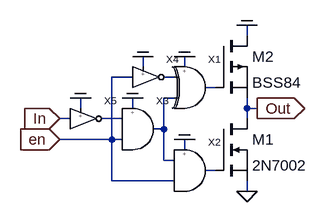
[diagram p0: schematic nm_enable.asc]
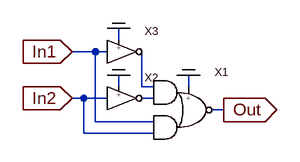
[diagram p1: sub-circuit nm_xor.asc]
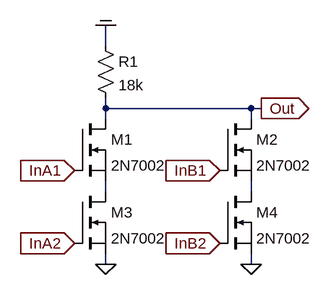
[diagram p2: sub-circuit nm_aoi2x2.asc]
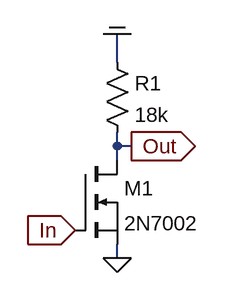
[diagram p3: sub-circuit nm_not.asc]
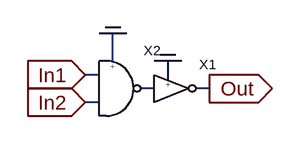
[diagram p4: sub-circuit nm_and.asc]
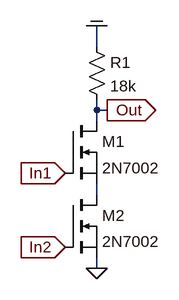
[diagram p5: sub-circuit nm_nand.asc]
nm_enable.asc, the LTspice schematic file:
Version 4
SHEET 1 880 680
WIRE 288 128 288 112
WIRE 128 176 128 160
WIRE 192 176 192 160
WIRE 112 192 80 192
WIRE 176 192 160 192
WIRE 240 208 224 208
WIRE 176 224 160 224
WIRE 32 240 32 224
WIRE 112 240 112 224
WIRE 288 240 288 224
WIRE 304 240 288 240
WIRE 16 256 0 256
WIRE 96 256 64 256
WIRE 288 256 288 240
WIRE 160 272 160 224
WIRE 160 272 144 272
WIRE 80 288 80 192
WIRE 80 288 0 288
WIRE 96 288 80 288
WIRE 192 304 192 288
WIRE 160 320 160 272
WIRE 176 320 160 320
WIRE 240 336 224 336
WIRE 80 352 80 288
WIRE 176 352 80 352
WIRE 288 368 288 352
FLAG 0 256 In
IOPIN 0 256 In
FLAG 304 240 Out
IOPIN 304 240 Out
FLAG 288 112 COM
FLAG 288 368 0
FLAG 0 288 en
IOPIN 0 288 In
FLAG 192 160 COM
FLAG 128 160 COM
FLAG 192 288 COM
FLAG 112 224 COM
FLAG 32 224 COM
SYMBOL nmos 240 256 R0
SYMATTR InstName M1
SYMATTR Value 2N7002
SYMBOL pmos 240 128 R0
SYMATTR InstName M2
SYMATTR Value BSS84
SYMBOL nm_xor 192 208 R0
SYMATTR InstName X1
SYMBOL nm_and 192 336 R0
SYMATTR InstName X2
SYMBOL nm_and 112 272 R0
SYMATTR InstName X3
SYMBOL nm_not 128 192 R0
SYMATTR InstName X4
SYMBOL nm_not 32 256 R0
SYMATTR InstName X5

nm_xor.asc, the sub-circuit schematic file:
Version 4
SHEET 1 880 680
WIRE 320 32 320 16
WIRE 288 48 256 48
WIRE 304 48 288 48
WIRE 320 96 320 80
WIRE 352 96 352 48
WIRE 368 96 352 96
WIRE 416 96 416 80
WIRE 272 112 256 112
WIRE 304 112 272 112
WIRE 368 112 352 112
WIRE 464 128 448 128
WIRE 288 144 288 48
WIRE 368 144 288 144
WIRE 272 160 272 112
WIRE 368 160 272 160
FLAG 256 48 In1
IOPIN 256 48 In
FLAG 464 128 Out
IOPIN 464 128 Out
FLAG 256 112 In2
IOPIN 256 112 In
FLAG 320 16 COM
FLAG 320 80 COM
FLAG 416 80 COM
SYMBOL nm_aoi2x2 400 128 R0
SYMATTR InstName X1
SYMBOL nm_not 320 112 R0
SYMATTR InstName X2
SYMBOL nm_not 320 48 R0
SYMATTR InstName X3

nm_aoi2x2.asc, the sub-circuit schematic file:
Version 4
SHEET 1 1092 680
WIRE 224 32 224 0
WIRE 224 128 224 112
WIRE 448 128 224 128
WIRE 464 128 448 128
WIRE 224 144 224 128
WIRE 448 144 448 128
WIRE 224 256 224 240
WIRE 448 256 448 240
WIRE 224 368 224 352
WIRE 448 368 448 352
FLAG 176 224 InA1
IOPIN 176 224 In
FLAG 464 128 Out
IOPIN 464 128 Out
FLAG 224 0 COM
FLAG 448 368 0
FLAG 400 224 InB1
IOPIN 400 224 In
FLAG 224 368 0
FLAG 176 336 InA2
IOPIN 176 336 In
FLAG 400 336 InB2
IOPIN 400 336 In
SYMBOL nmos 176 144 R0
SYMATTR InstName M1
SYMATTR Value 2N7002
SYMBOL res 208 16 R0
SYMATTR InstName R1
SYMATTR Value 18k
SYMBOL nmos 400 144 R0
SYMATTR InstName M2
SYMATTR Value 2N7002
SYMBOL nmos 176 256 R0
SYMATTR InstName M3
SYMATTR Value 2N7002
SYMBOL nmos 400 256 R0
SYMATTR InstName M4
SYMATTR Value 2N7002

nm_not.asc, the sub-circuit schematic file:
Version 4
SHEET 1 880 680
WIRE 224 32 224 0
WIRE 224 128 224 112
WIRE 240 128 224 128
WIRE 224 144 224 128
WIRE 224 256 224 240
FLAG 224 256 0
FLAG 176 224 In
IOPIN 176 224 In
FLAG 240 128 Out
IOPIN 240 128 Out
FLAG 224 0 COM
SYMBOL nmos 176 144 R0
SYMATTR InstName M1
SYMATTR Value 2N7002
SYMBOL res 208 16 R0
SYMATTR InstName R1
SYMATTR Value 18k

nm_and.asc, the sub-circuit schematic file:
Version 4
SHEET 1 880 680
WIRE 128 96 128 64
WIRE 112 112 96 112
WIRE 192 112 192 96
WIRE 176 128 160 128
WIRE 240 128 224 128
WIRE 112 144 96 144
FLAG 96 112 In1
IOPIN 96 112 In
FLAG 240 128 Out
IOPIN 240 128 Out
FLAG 192 96 COM
FLAG 96 144 In2
IOPIN 96 144 In
FLAG 128 64 COM
SYMBOL nm_not 192 128 R0
SYMATTR InstName X1
SYMBOL nm_nand 128 128 R0
SYMATTR InstName X2

nm_nand.asc, the sub-circuit schematic file:
Version 4
SHEET 1 880 680
WIRE 224 32 224 0
WIRE 224 128 224 112
WIRE 240 128 224 128
WIRE 224 144 224 128
WIRE 224 256 224 240
WIRE 224 368 224 352
FLAG 176 224 In1
IOPIN 176 224 In
FLAG 240 128 Out
IOPIN 240 128 Out
FLAG 224 0 COM
FLAG 224 368 0
FLAG 176 336 In2
IOPIN 176 336 In
SYMBOL nmos 176 144 R0
SYMATTR InstName M1
SYMATTR Value 2N7002
SYMBOL res 208 16 R0
SYMATTR InstName R1
SYMATTR Value 18k
SYMBOL nmos 176 256 R0
SYMATTR InstName M2
SYMATTR Value 2N7002

The netlist it stands for:
* nm_enable.asc
M1 Out N005 0 0 2N7002
M2 COM N002 Out Out BSS84
XX1 N003 N002 COM N001 nm_xor
XX2 en N005 COM N003 nm_and
XX3 en N003 COM N004 nm_and
XX4 en N001 COM nm_not
XX5 In N004 COM nm_not

* block symbol definitions
.subckt nm_xor In2 Out COM In1
XX1 N002 Out COM N001 In1 In2 nm_aoi2x2
XX2 In2 N002 COM nm_not
XX3 In1 N001 COM nm_not
.ends nm_xor

.subckt nm_aoi2x2 InA2 Out COM InA1 InB1 InB2
M1 Out InA1 N001 N001 2N7002
R1 COM Out 18k
M2 Out InB1 N002 N002 2N7002
M3 N001 InA2 0 0 2N7002
M4 N002 InB2 0 0 2N7002
.ends nm_aoi2x2

.subckt nm_not In Out COM
M1 Out In 0 0 2N7002
R1 COM Out 18k
.ends nm_not

.subckt nm_and In2 Out COM In1
XX1 N001 Out COM nm_not
XX2 In2 N001 COM In1 nm_nand
.ends nm_and

.subckt nm_nand In2 Out COM In1
M1 Out In1 N001 N001 2N7002
R1 COM Out 18k
M2 N001 In2 0 0 2N7002
.ends nm_nand

.model NMOS NMOS
.model PMOS PMOS
.lib standard.mos
.backanno
.end